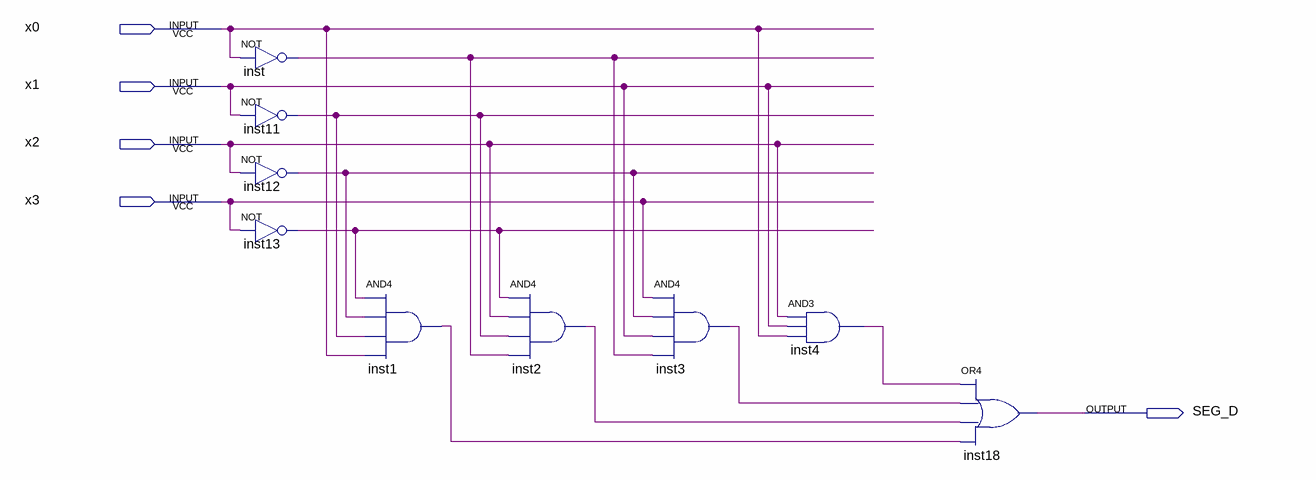
[diagram p0: schematic sheet]
// Quartus schematic SEG_D.bdf as structural Verilog: 9 symbols, 5 pins
module SEG_D (
  input  x0,
  input  x1,
  input  x2,
  input  x3,
  output SEG_D
);

  wire inst1_out, inst2_out, inst3_out, inst4_out, inst11_out, inst12_out, inst13_out, inst_out;

  not inst (inst_out, x0);
  not inst11 (inst11_out, x1);
  not inst12 (inst12_out, x2);
  not inst13 (inst13_out, x3);
  and inst1 (inst1_out, inst13_out, inst12_out, inst11_out, x0);
  and inst2 (inst2_out, inst13_out, x2, inst11_out, inst_out);
  and inst3 (inst3_out, x3, inst12_out, x1, inst_out);
  and inst4 (inst4_out, x2, x1, x0);
  or inst18 (SEG_D, inst4_out, inst3_out, inst2_out, inst1_out);
endmodule
